# EAGLE design QBuzz-V1 (EAGLE 6.0)
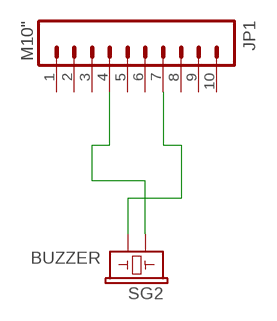
[diagram p0: schematic, sheet 1]

## Parts
JP1  M10"  [1X10]
SG2  BUZZER  BUZZERPTH  [BUZZER-12MM]

## Nets
N$1: JP1.4 SG2.+
N$2: JP1.7 SG2.-
Unconnected: JP1.1 JP1.2 JP1.3 JP1.5 JP1.6 JP1.8 JP1.9 JP1.10

## Library data of the parts
JP1 = SFE Connectors:M10: Header 10 Standard 10-pin 0.1" header. Use with straight break away headers (SKU : PRT-00116), right angle break away headers (PRT-00553), swiss pins (PRT-00743), machine pins (PRT-00117), and female headers (PRT-00115).
SG2 = SFE Electromechanical:BUZZER: Buzzer 12mm Spark Fun Electronics SKU : Comp-Buzzer

## Board
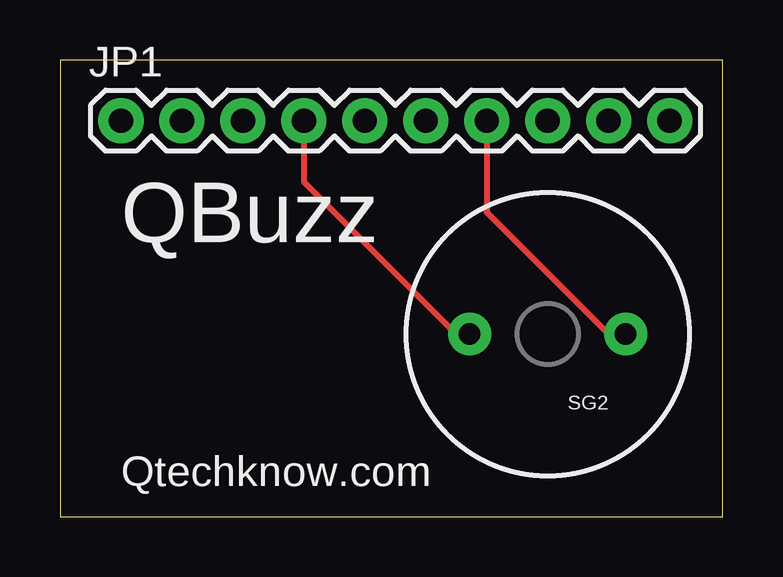
[diagram p1: board, top side]
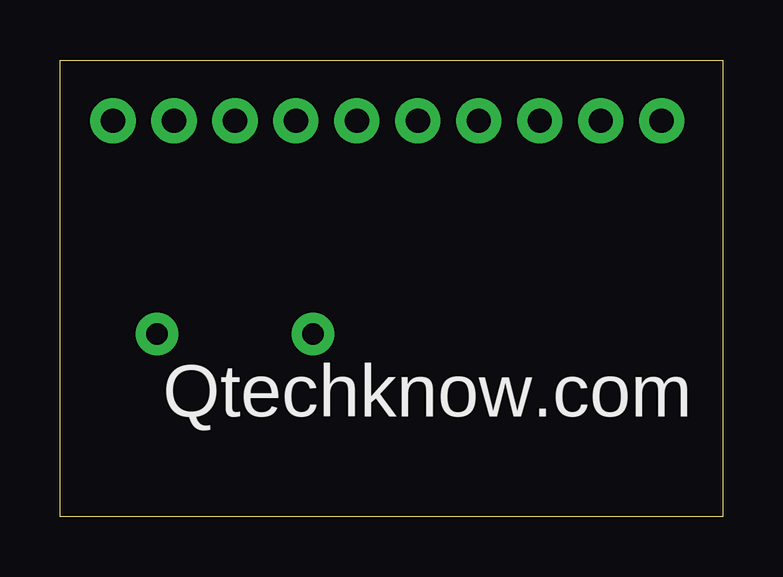
[diagram p2: board, bottom side, seen from below]

Size 27.61 x 19.04 mm. Coordinates in mm from the lower left corner, seen from the top.
Outline: 0,0 27.61,0 27.61,19.04 0,19.04 0,0
Copper layers (1*16): Top 0.035mm / dielectric 1.5mm / Bottom 0.035mm
Design rules: minimum track width 10mil, minimum drill 24mil, track to track 8mil, track to pad 8mil, pad to pad 8mil, via to via 8mil, smd to smd 8mil, copper to edge 40mil, drill to drill 8mil, minimum pad ring 10mil, minimum via ring 8mil, stop-mask expansion 4mil, vias tented up to drill 0mil, thermal gap 10mil

### Footprints (pad centres in the part's own frame; a part is rotated, then mirrored left to right if it is on the bottom)
1X10 = drill 1.016 pad 1.88: 1 0,0; 2 2.54,0; 3 5.08,0; 4 7.62,0; 5 10.16,0; 6 12.7,0; 7 15.24,0; 8 17.78,0; 9 20.32,0; 10 22.86,0
BUZZER-12MM = drill 0.9 pad 1.778: + 3.25,0; - -3.25,0

### Placement (x,y rotation side)
JP1  2.54,16.51 0 top
SG2  BUZZERPTH  [BUZZER-12MM]  20.32,7.62 180 top

### Tracks (layer width: path | path; a pad name or v marks a point on that pad's centre or on a via)
N$1
  Top 0.254: JP1.4 10.16,13.97 16.51,7.62 SG2.+
N$2
  Top 0.254: JP1.7 17.78,12.7 22.86,7.62 SG2.-

### Text on the board
tPlace: QBuzz | Qtechknow.com
bPlace: Qtechknow.com